# EAGLE design nano_ieee488_v1.1b (EAGLE 6.4)
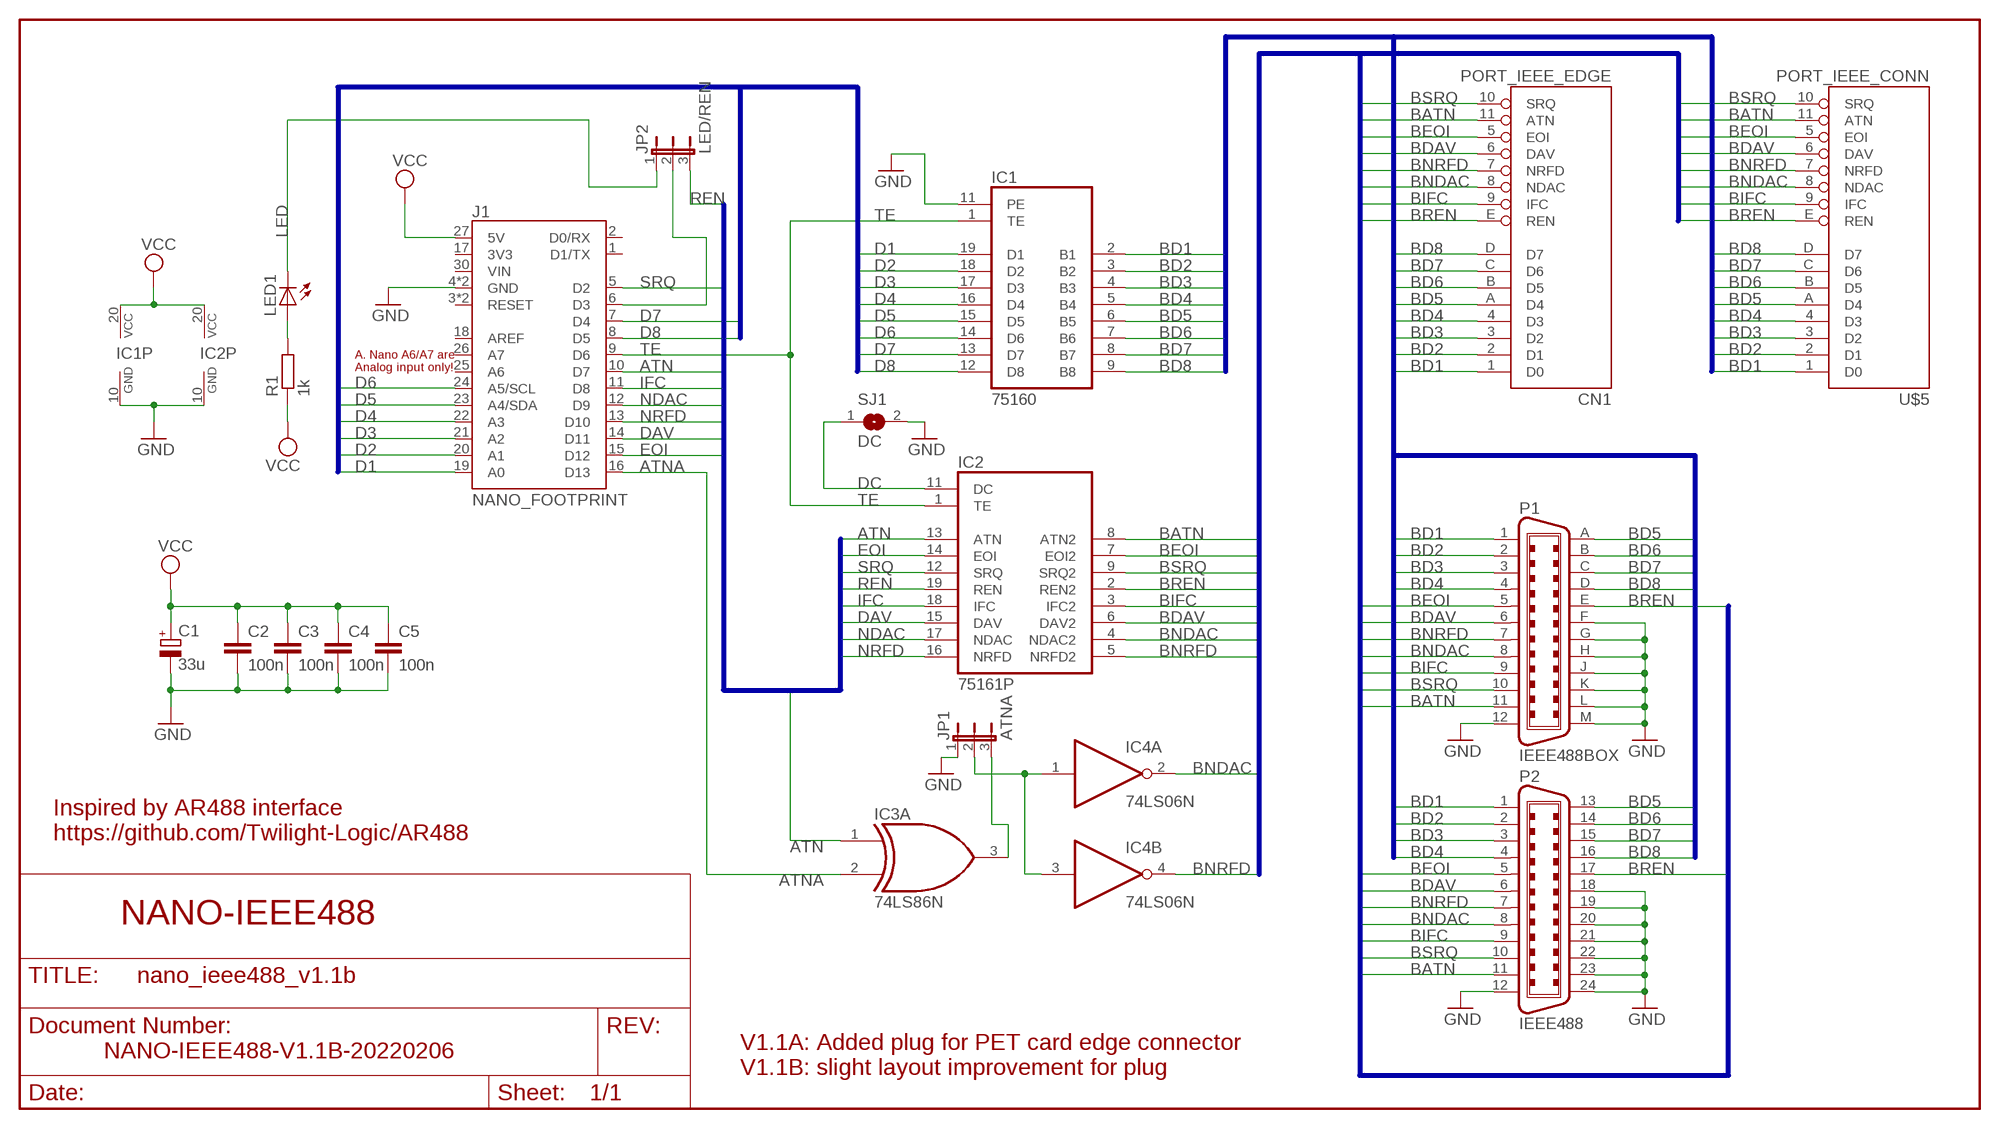
[diagram p0: schematic, sheet 1]

## Parts
C1  33u  CPOL-EUE2.5-7  [E2,5-7]
C2  100n  C-EU025-025X050  [C025-025X050]
C3  100n  C-EU025-025X050  [C025-025X050]
C4  100n  C-EU025-025X050  [C025-025X050]
C5  100n  C-EU025-025X050  [C025-025X050]
CN1  PORT_IEEE_EDGE  [MA156_12-2_IEEE]
IC1  75160  75160P  [DIL20]
IC2  75161P  [DIL20]
IC3  74LS86N  [DIL14]
IC4  74LS06N  [DIL14]
J1  NANO_FOOTPRINT  [NANO]
JP1  ATNA  JP2E  [JP2]
JP2  LED/REN  JP2E  [JP2]
LED1  LED3MM  [LED3MM]
P1  IEEE488BOX  [FLAT24BOX]
P2  IEEE488  [24HP]
R1  1k  R-EU_0204/5  [0204/5]
SJ1  DC  SJW  [SJW]
U$5  PORT_IEEE_CONN  [MA156_12-2_SHORT]

## Nets
ATN: IC2.13(ATN) IC3.1(A:I0) J1.10(D7)
ATNA: IC3.2(A:I1) J1.16(D13)
BATN: CN1.11(ATN) IC2.8(ATN2) P1.11 P2.11 U$5.11(ATN)
BD1: CN1.1(D0) IC1.2(B1) P1.1 P2.1 U$5.1(D0)
BD2: CN1.2(D1) IC1.3(B2) P1.2 P2.2 U$5.2(D1)
BD3: CN1.3(D2) IC1.4(B3) P1.3 P2.3 U$5.3(D2)
BD4: CN1.4(D3) IC1.5(B4) P1.4 P2.4 U$5.4(D3)
BD5: CN1.A(D4) IC1.6(B5) P1.A P2.13 U$5.A(D4)
BD6: CN1.B(D5) IC1.7(B6) P1.B P2.14 U$5.B(D5)
BD7: CN1.C(D6) IC1.8(B7) P1.C P2.15 U$5.C(D6)
BD8: CN1.D(D7) IC1.9(B8) P1.D P2.16 U$5.D(D7)
BDAV: CN1.6(DAV) IC2.6(DAV2) P1.6 P2.6 U$5.6(DAV)
BEOI: CN1.5(EOI) IC2.7(EOI2) P1.5 P2.5 U$5.5(EOI)
BIFC: CN1.9(IFC) IC2.3(IFC2) P1.9 P2.9 U$5.9(IFC)
BNDAC: CN1.8(NDAC) IC2.4(NDAC2) IC4.2(A:O) P1.8 P2.8 U$5.8(NDAC)
BNRFD: CN1.7(NRFD) IC2.5(NRFD2) IC4.4(B:O) P1.7 P2.7 U$5.7(NRFD)
BREN: CN1.E(REN) IC2.2(REN2) P1.E P2.17 U$5.E(REN)
BSRQ: CN1.10(SRQ) IC2.9(SRQ2) P1.10 P2.10 U$5.10(SRQ)
D1: IC1.19(D1) J1.19(A0)
D2: IC1.18(D2) J1.20(A1)
D3: IC1.17(D3) J1.21(A2)
D4: IC1.16(D4) J1.22(A3)
D5: IC1.15(D5) J1.23(A4/SDA)
D6: IC1.14(D6) J1.24(A5/SCL)
D7: IC1.13(D7) J1.7(D4)
D8: IC1.12(D8) J1.8(D5)
DAV: IC2.15(DAV) J1.14(D11)
DC: IC2.11(DC) SJ1.1
EOI: IC2.14(EOI) J1.15(D12)
GND: C1.- C2.2 C3.2 C4.2 C5.2 IC1.10(GND) IC1.11(PE) IC2.10(GND) J1.4(GND) J1.29(GND) JP1.1 P1.12 P1.F P1.G P1.H P1.J P1.K P1.L P1.M P2.12 P2.18 P2.19 P2.20 P2.21 P2.22 P2.23 P2.24 SJ1.2
IFC: IC2.18(IFC) J1.11(D8)
LED: JP2.1 LED1.K(C)
N$1: IC3.3(A:O) JP1.3
N$2: IC4.1(A:I) IC4.3(B:I) JP1.2
N$3: LED1.A R1.2
N$4: J1.6(D3) JP2.2
NDAC: IC2.17(NDAC) J1.12(D9)
NRFD: IC2.16(NRFD) J1.13(D10)
REN: IC2.19(REN) JP2.3
SRQ: IC2.12(SRQ) J1.5(D2)
TE: IC1.1(TE) IC2.1(TE) J1.9(D6)
VCC: C1.+ C2.1 C3.1 C4.1 C5.1 IC1.20(VCC) IC2.20(VCC) J1.27(5V) R1.1
Unconnected: IC3.4(B:I0) IC3.5(B:I1) IC3.6(B:O) IC3.8(C:O) IC3.9(C:I0) IC3.10(C:I1) IC3.11(D:O) IC3.12(D:I0) IC3.13(D:I1) IC4.5(C:I) IC4.6(C:O) IC4.8(D:O) IC4.9(D:I) IC4.10(E:O) IC4.11(E:I) IC4.12(F:O) IC4.13(F:I) J1.1(D1/TX) J1.2(D0/RX) J1.3(RESET) J1.17(3V3) J1.18(AREF) J1.25(A6) J1.26(A7) J1.28(RESET) J1.30(VIN)

## Buses
D[1..8]
ATN,EOI,SRQ,REN,IFC,DAV,NDAC,NRFD
BD[1..8]
BATN,BEOI,BSRQ,BREN,BIFC,BDAV,BNDAC,BNRFD

## Notes on the sheet
- A. Nano A6/A7 are
  Analog input only!
- Inspired by AR488 interface
  https://github.com/Twilight-Logic/AR488
- NANO-IEEE488
- NANO-IEEE488-V1.1B-20220206
- V1.1A: Added plug for PET card edge connector
  V1.1B: slight layout improvement for plug

## Power pins joined to a net without a drawn wire
GND: CN1.12(GND) CN1.F(GND) CN1.H(GND) CN1.J(GND) CN1.K(GND) CN1.L(GND) CN1.M(GND) CN1.N(GND) IC3.7(P:GND) IC4.7(P:GND) U$5.12(GND) U$5.F(GND) U$5.H(GND) U$5.J(GND) U$5.K(GND) U$5.L(GND) U$5.M(GND) U$5.N(GND)
VCC: IC3.14(P:VCC) IC4.14(P:VCC)

## Library data of the parts
C1 = rcl:CPOL-EU: POLARIZED CAPACITOR, European symbol
C2-C5 = rcl:C-EU: CAPACITOR, European symbol
CN1 = commodore:PORT_IEEE_EDGE: IEEE connector for various Commodore computers, PET/CBM type, edge version
IC1 = 751xx:75160: 75xxx DEVICE
IC2 = 751xx:75161: 75xxx DEVICE
IC3 = 74xx-us:74*86: Quad 2-input EXCLUSIV-OR (XOR) gate
IC4 = 74xx-us:74*06: Hex INVERTER, open collector high-voltage output
J1 = SparkFun-Boards:NANO_FOOTPRINT: Generic Nano Footprint
JP1 JP2 = jumper:JP2E: JUMPER
LED1 = led:LED: LED OSRAM: - CHIPLED LG R971, LG N971, LY N971, LG Q971, LY Q971, LO R971, LY R971 LH N974, LH R974 LS Q976, LO Q976, LY Q976 LO Q996 - Hyper CHIPLED LW Q18S LB Q993, LB Q99A, LB R99A - SideLED LS A670, LO A670, LY A670, LG A670, LP A670 LB A673, LV A673, LT A673, LW A673 LH A674 LY A675 LS A676, LA A676, LO A676, LY A676, LW A676 LS A679, LY A679, LG A679 - Hyper Micro SIDELED® LS Y876, LA Y876, LO Y876, LY Y876 LT Y87S - SmartLED LW L88C, LW L88S LB L89C, LB L89S, LG L890 LS L89K, LO L89K, LY L89K LS L896, LA L896, LO L896, LY L896 - TOPLED LS T670, LO T670, LY T670, LG T670, LP T670 LSG T670, LSP T670, LSY T670, LOP T670, LYG T670 LG T671, LOG T671, LSG T671 LB T673, LV T673, LT T673, LW T673 LH T674 LS T676, LA T676, LO T676, LY T676, LB T676, LH T676, LSB T676, LW T676 LB T67C, LV T67C, LT T67C, LS T67K, LO T67K, LY T67K, LW E67C LS E67B, LA E67B, LO E67B, LY E67B, LB E67C, LV E67C, LT E67C LW T67C LS T679, LY T679, LG T679 LS T770, LO T770, LY T770, LG T770, LP T770 LB T773, LV T773, LT T773, LW T773 LH T774 LS E675, LA E675, LY E675, LS T675 LS T776, LA T776, LO T776, LY T776, LB T776 LHGB T686 LT T68C, LB T68C - Hyper Mini TOPLED® LB M676 - Mini TOPLED Santana® LG M470 LS M47K, LO M47K, LY M47K Source: http://www.osram.convergy.de LUXEON: - LUMILED® LXK2-PW12-R00, LXK2-PW12-S00, LXK2-PW14-U00, LXK2-PW14-V00 LXK2-PM12-R00, LXK2-PM12-S00, LXK2-PM14-U00 LXK2-PE12-Q00, LXK2-PE12-R00, LXK2-PE12-S00, LXK2-PE14-T00, LXK2-PE14-U00 LXK2-PB12-K00, LXK2-PB12-L00, LXK2-PB12-M00, LXK2-PB14-N00, LXK2-PB14-P00, LXK2-PB14-Q00 LXK2-PR12-L00, LXK2-PR12-M00, LXK2-PR14-Q00, LXK2-PR14-R00 LXK2-PD12-Q00, LXK2-PD12-R00, LXK2-PD12-S00 LXK2-PH12-R00, LXK2-PH12-S00 LXK2-PL12-P00, LXK2-PL12-Q00, LXK2-PL12-R00 Source: www.luxeon.com KINGBRIGHT: KA-3528ASYC Source: www.kingbright.com
P1 P2 = csa:IEEE488
R1 = rcl:R-EU_: RESISTOR, European symbol
SJ1 = jumper:SJ: SMD solder JUMPER
U$5 = commodore:PORT_IEEE_CONN

## Board
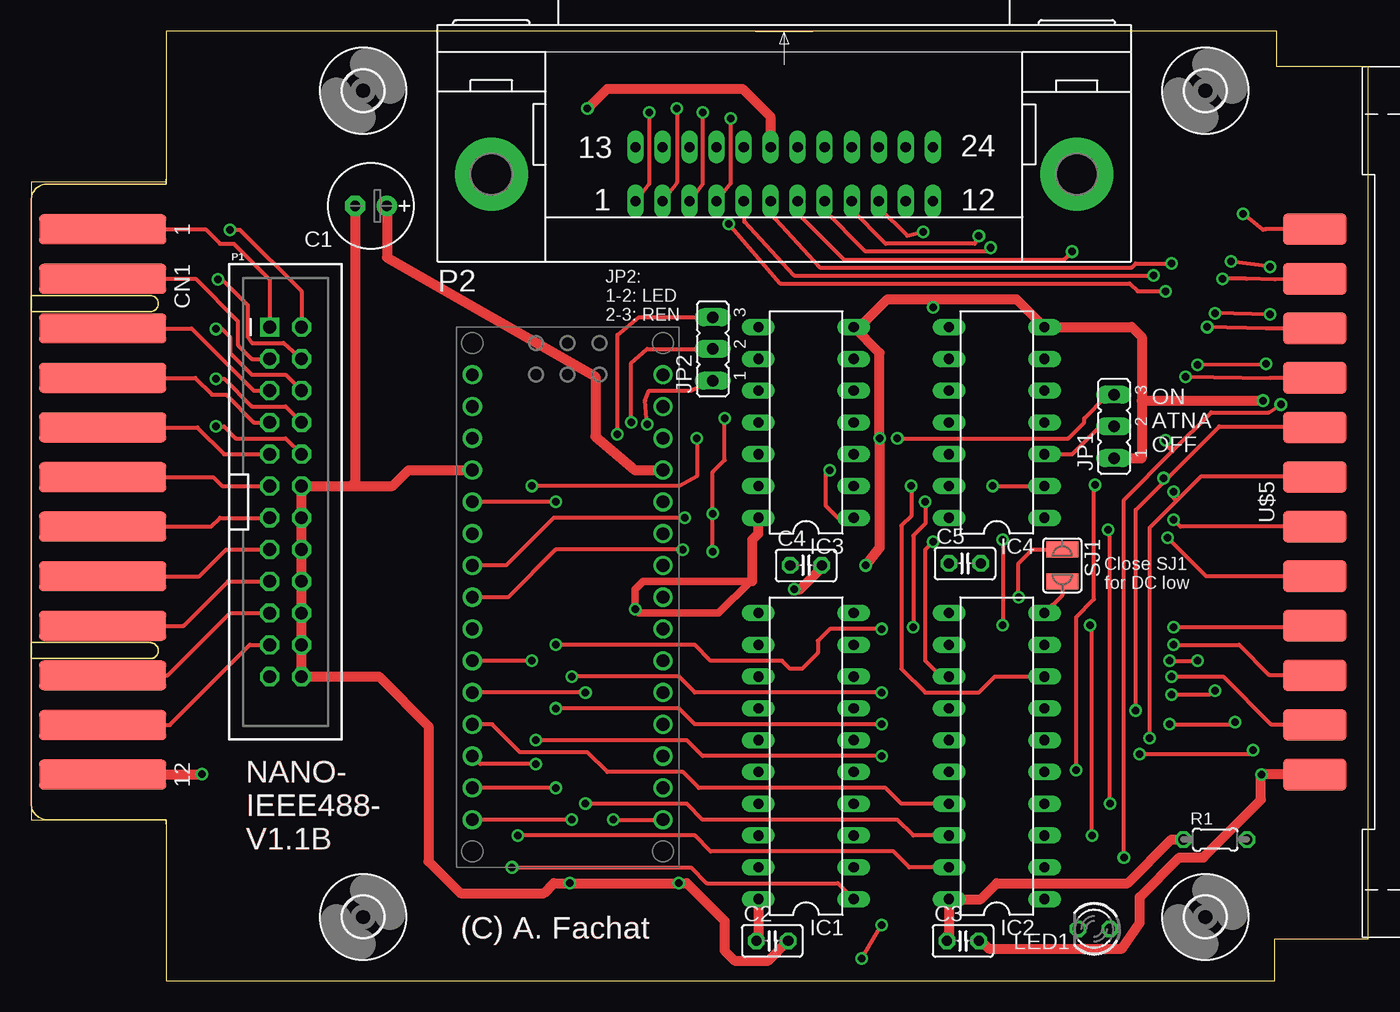
[diagram p1: board, top side]
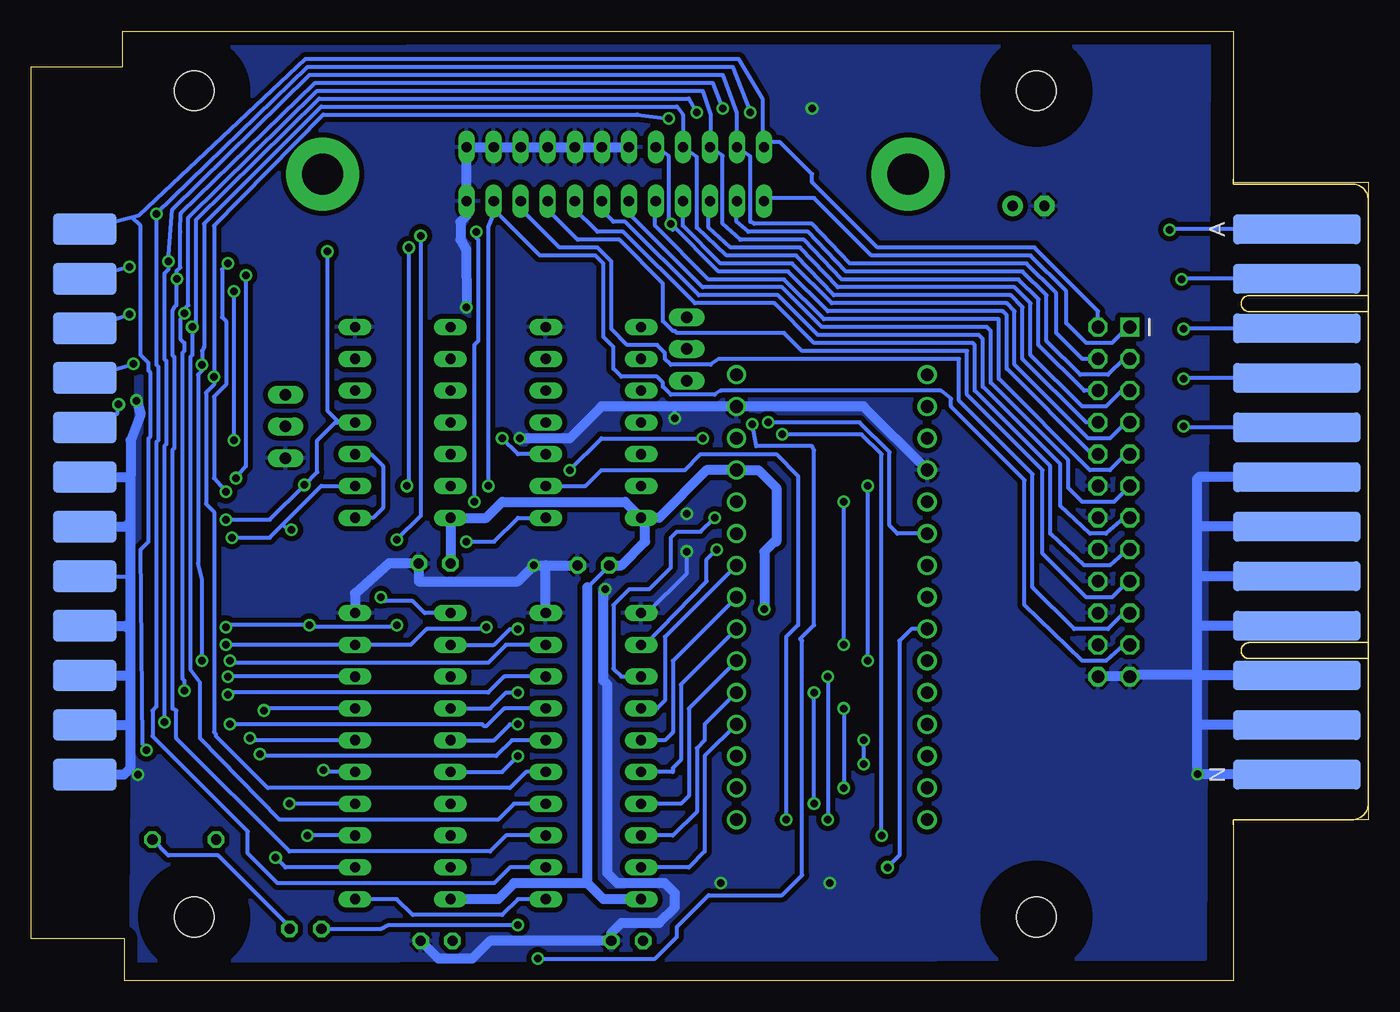
[diagram p2: board, bottom side, seen from below]

Size 106.84 x 75.87 mm. Coordinates in mm from the lower left corner, seen from the top.
Outline: 10.79,0 99.36,0 99.38,3.33 106.84,3.33 106.84,73.03 99.54,73.03 99.54,75.87 10.79,75.87 10.79,63.82 0,63.82 0,12.86 10.79,12.86 10.79,0
Copper layers (1*16): Top 0.035mm / dielectric 1.5mm / Bottom 0.035mm
Design rules "default *": minimum track width 10mil, minimum drill 12mil, track to track 8mil, track to pad 8mil, pad to pad 8mil, via to via 8mil, smd to smd 8mil, copper to edge 40mil, drill to drill 8mil, minimum pad ring 10mil, minimum via ring 8mil, stop-mask expansion 4mil, vias tented up to drill 0mil, thermal gap 10mil

### Footprints (pad centres in the part's own frame; a part is rotated, then mirrored left to right if it is on the bottom)
E2,5-7 = drill 0.813 pad 1.6: + -1.27,0 | drill 0.813 pad 1.6 octagon: - 1.27,0
C025-025X050 = drill 0.813 octagon: 1 -1.27,0; 2 1.27,0
MA156_12-2_IEEE = smd 2.388 x 10.16: 1 -21.793,0; 2 -17.831,0; 3 -13.868,0; 4 -9.906,0; 5 -5.944,0; 6 -1.981,0; 7 1.981,0; 8 5.944,0; 9 9.906,0; 10 13.868,0; 11 17.831,0; 12 21.793,0 | smd 2.388 x 10.16 bottom: A -21.793,0; B -17.831,0; C -13.868,0; D -9.906,0; E -5.944,0; F -1.981,0; H 1.981,0; J 5.944,0; K 9.906,0; L 13.868,0; M 17.831,0; N 21.793,0
DIL20 = drill 0.813 long: 1 -11.43,-3.81; 2 -8.89,-3.81; 3 -6.35,-3.81; 4 -3.81,-3.81; 5 -1.27,-3.81; 6 1.27,-3.81; 7 3.81,-3.81; 8 6.35,-3.81; 9 8.89,-3.81; 10 11.43,-3.81; 11 11.43,3.81; 12 8.89,3.81; 13 6.35,3.81; 14 3.81,3.81; 15 1.27,3.81; 16 -1.27,3.81; 17 -3.81,3.81; 18 -6.35,3.81; 19 -8.89,3.81; 20 -11.43,3.81
DIL14 = drill 0.813 long: 1 -7.62,-3.81; 2 -5.08,-3.81; 3 -2.54,-3.81; 4 0,-3.81; 5 2.54,-3.81; 6 5.08,-3.81; 7 7.62,-3.81; 8 7.62,3.81; 9 5.08,3.81; 10 2.54,3.81; 11 0,3.81; 12 -2.54,3.81; 13 -5.08,3.81; 14 -7.62,3.81
NANO = drill 1.016: 1 -7.62,17.78; 2 -7.62,15.24; 3 -7.62,12.7; 4 -7.62,10.16; 5 -7.62,7.62; 6 -7.62,5.08; 7 -7.62,2.54; 8 -7.62,0; 9 -7.62,-2.54; 10 -7.62,-5.08; 11 -7.62,-7.62; 12 -7.62,-10.16; 13 -7.62,-12.7; 14 -7.62,-15.24; 15 -7.62,-17.78; 16 7.62,-17.78; 17 7.62,-15.24; 18 7.62,-12.7; 19 7.62,-10.16; 20 7.62,-7.62; 21 7.62,-5.08; 22 7.62,-2.54; 23 7.62,0; 24 7.62,2.54; 25 7.62,5.08; 26 7.62,7.62; 27 7.62,10.16; 28 7.62,12.7; 29 7.62,15.24; 30 7.62,17.78
JP2 = drill 0.914 long: 1 -2.54,0; 2 0,0; 3 2.54,0
LED3MM = drill 0.813 octagon: A -1.27,0; K 1.27,0
FLAT24BOX = drill 1.016 square: 1 -13.97,-1.27 | drill 1.016 octagon: 2 -11.43,-1.27; 3 -8.89,-1.27; 4 -6.35,-1.27; 5 -3.81,-1.27; 6 -1.27,-1.27; 7 1.27,-1.27; 8 3.81,-1.27; 9 6.35,-1.27; 10 8.89,-1.27; 11 11.43,-1.27; 12 13.97,-1.27; A -13.97,1.27; B -11.43,1.27; C -8.89,1.27; D -6.35,1.27; E -3.81,1.27; F -1.27,1.27; G 1.27,1.27; H 3.81,1.27; J 6.35,1.27; K 8.89,1.27; L 11.43,1.27; M 13.97,1.27
24HP = drill 0.813 long: 1 -11.874,-2.159; 2 -9.716,-2.159; 3 -7.556,-2.159; 4 -5.397,-2.159; 5 -3.239,-2.159; 6 -1.079,-2.159; 7 1.079,-2.159; 8 3.239,-2.159; 9 5.397,-2.159; 10 7.556,-2.159; 11 9.716,-2.159; 12 11.874,-2.159; 13 -11.874,2.159; 14 -9.716,2.159; 15 -7.556,2.159; 16 -5.397,2.159; 17 -3.239,2.159; 18 -1.079,2.159; 19 1.079,2.159; 20 3.239,2.159; 21 5.397,2.159; 22 7.556,2.159; 23 9.716,2.159; 24 11.874,2.159 | drill 3.302 pad 5.842: G -23.393,0; G1 23.393,0
0204/5 = drill 0.813 octagon: 1 -2.54,0; 2 2.54,0
SJW = smd 1.27 x 2.54: 1 -1.27,0; 2 1.27,0
3,2 = hole 3.2: 0,0
MA156_12-2_SHORT = smd 2.54 x 5.08: 1 -21.793,0; 2 -17.831,0; 3 -13.868,0; 4 -9.906,0; 5 -5.944,0; 6 -1.981,0; 7 1.981,0; 8 5.944,0; 9 9.906,0; 10 13.868,0; 11 17.831,0; 12 21.793,0 | smd 2.54 x 5.08 bottom: A -21.793,0; B -17.831,0; C -13.868,0; D -9.906,0; E -5.944,0; F -1.981,0; H 1.981,0; J 5.944,0; K 9.906,0; L 13.868,0; M 17.831,0; N 21.793,0

### Placement (x,y rotation side)
C1  27.15,61.91 180 top
C2  59.21,3.17 0 top
C3  74.45,3.17 0 top
C4  61.91,33.18 0 top
C5  74.61,33.34 0 top
CN1  5.71,38.26 270 top
IC1  61.91,17.94 90 top
IC2  77.15,17.94 90 top
IC3  61.91,44.61 90 top
IC4  77.15,44.61 90 top
J1  42.86,30.64 0 top
JP1  86.52,44.29 90 top
JP2  54.45,50.48 90 top
LED1  84.93,4.13 180 top
P1  20.32,38.26 270 top
P2  60.17,64.45 0 top
R1  94.62,11.27 0 top
SJ1  82.39,33.18 270 top
U$1  [3,2]  26.51,71.12 0 top
U$2  [3,2]  93.82,71.12 0 top
U$3  [3,2]  26.51,5.08 0 top
U$4  [3,2]  93.82,5.08 0 top
U$5  102.55,38.26 270 top

### Tracks (layer width: path | path; a pad name or v marks a point on that pad's centre or on a via)
ATN  (via drill 0.6)
  Top 0.305: IC2.13 72.71,24.29 71.44,25.56 71.44,34.45 v72.07,35.08 | IC3.1 64.45,36.99 63.5,37.94 63.5,40.48 v63.82,40.8 | v53.18,43.34 53.18,40.32 51.75,39.53 v40,39.53 | v40,25.56 J1.10
  Bottom 0.305: v72.07,35.08 69.85,35.08 67.94,36.99 IC3.1 | v63.82,40.8 61.28,43.34 v53.18,43.34 | v40,39.53 v40,25.56
ATNA  (via drill 0.6)
  Top 0.305: v46.51,12.86 J1.16
  Bottom 0.305: IC3.2 62.55,39.53 61.28,40.8 54.61,40.8 53.34,42.07 47.31,42.07 45.56,40.32 45.56,28.42 46.51,27.46 v46.51,12.86
BATN  (via drill 0.6)
  Top 0.305: CN1.11 11.06,20.43 17.46,26.83 P1.11 | U$5.11 102.5,20.48 99.06,20.48 95.25,24.29 v91.12,24.29 | v70.33,39.53 70.33,37.15 69.53,36.35 69.53,24.92 71.44,23.02 75.72,23.02 76.99,24.29 IC2.8
  Bottom 0.305: P1.11 19.53,26.83 20.95,25.56 22.86,25.56 27.46,30 27.46,40.01 33.34,45.88 33.34,46.51 34.13,47.15 51.75,47.15 52.23,46.83 55.72,46.83 56.36,47.47 56.36,47.78 56.83,48.26 59.69,48.26 60.32,48.9 60.32,50.64 61.12,51.44 61.12,57.31 61.75,57.94 66.2,57.94 69.85,61.59 69.85,62.58 P2.11 69.77,62.18 69.77,61.52 70.33,60.17 v70.33,39.53 | IC2.8 v91.12,24.29
BD1  (via drill 0.6)
  Top 0.305: CN1.1 13.93,60.05 15.08,58.9 16.19,58.9 19.05,56.04 P1.1 | U$5.1 98.63,60.05 98.42,60.01 v96.84,61.28 | v49.37,69.37 49.37,63.69 P2.1
  Bottom 0.305: IC1.2 68.58,9.05 69.85,7.78 87.15,7.78 89.53,10.16 89.53,11.91 97.15,19.53 97.15,21.59 96.84,21.91 96.84,43.02 96.68,43.18 96.68,49.05 96.84,49.21 v96.84,61.28 84.77,73.03 50.8,73.03 v49.37,69.37 | P1.1 19.21,52.23 20.48,50.96 22.54,50.96 24.13,52.55 24.13,55.09 26.99,57.94 39.69,57.94 44.29,62.55 48.23,62.55 P2.1
BD2  (via drill 0.6)
  Top 0.305: CN1.2 13.13,56.09 16.51,52.7 16.51,50.8 17.62,49.69 P1.2 | U$5.2 99.38,56.04 97.1,56.09 v95.2,56.09 | v51.59,69.69 51.59,63.75 P2.2
  Bottom 0.305: IC1.3 68.9,11.59 70.17,10.32 86.2,10.32 95.25,19.37 95.25,21.59 95.57,21.75 95.57,42.39 95.41,42.55 95.41,49.85 95.57,50.01 95.57,53.5 95.41,53.82 95.25,53.98 95.25,56.04 v95.2,56.09 95.2,56.73 94.93,56.99 94.93,59.85 94.88,61.33 84.14,71.75 52.39,71.75 v51.59,69.69 | P1.2 19.53,49.69 20.8,48.42 23.02,48.42 25.72,51.12 25.72,54.77 27.62,56.67 41.75,56.67 44.77,59.85 49.53,59.85 50.48,60.64 50.48,62.58 P2.2
BD3  (via drill 0.6)
  Top 0.305: CN1.3 12.8,52.13 17.78,47.15 P1.3 | U$5.3 98.69,52.13 v93.98,52.23 | v53.66,69.37 53.66,63.66 P2.3
  Bottom 0.305: IC1.4 68.26,14.13 69.53,12.86 86.99,12.86 93.34,19.37 93.34,23.81 94.14,24.92 94.14,49.85 93.98,50.01 v93.98,52.23 93.66,52.55 93.66,60.8 83.82,70.48 54.29,70.48 v53.66,69.37 | P1.3 19.68,47.15 20.95,45.88 22.86,45.88 26.99,50.01 26.99,54.13 28.26,55.4 42.39,55.4 45.4,58.58 50.96,58.58 52.7,60.17 52.7,62.52 P2.3
BD4  (via drill 0.6)
  Top 0.305: CN1.4 13.11,48.16 14.45,46.83 15.56,46.83 17.78,44.61 P1.4 | U$5.4 99,48.16 v92.23,48.26 | v55.88,68.9 55.88,63.72 P2.4
  Bottom 0.305: IC1.5 67.31,16.67 68.58,15.4 87.95,15.4 92.07,19.53 92.07,19.68 92.23,19.84 92.23,37.47 92.87,38.1 92.87,46.99 92.23,47.62 v92.23,48.26 92.23,60.33 83.5,69.22 58.42,69.22 v55.88,68.9 | P1.4 19.37,44.61 20.64,43.34 22.38,43.34 28.26,49.21 28.26,53.5 28.89,54.13 42.86,54.13 46.04,57.31 51.75,57.31 54.77,60.33 P2.4
BD5  (via drill 0.6)
  Top 0.305: v15.87,60.01 16.67,60.01 21.59,55.09 P1.A | v88.58,18.1 97.31,18.1 v97.63,18.41
  Bottom 0.305: CN1.A 15.83,60.05 v15.87,60.01 | P1.A 21.59,53.5 26.67,58.58 39.21,58.58 44.45,63.82 44.45,64.45 46.99,66.99 48.23,66.99 P2.13 48.42,67.06 48.42,70.48 50.32,73.66 84.93,73.66 98.22,61.16 98.8,61.01 | U$5.A 98.8,61.01 | IC1.6 68.42,19.21 69.69,17.94 88.42,17.94 v88.58,18.1 | v97.63,18.41 97.63,18.57 97.95,18.89 98.11,34.45 97.47,35.08 97.47,43.34 97.31,43.5 97.31,48.58 97.47,48.74 97.47,49.37 98.11,50.01 98.11,60.32 98.8,61.01
BD6  (via drill 0.6)
  Top 0.305: v14.92,56.04 15.24,56.04 17.3,53.98 17.3,51.44 17.62,50.96 20.16,50.96 P1.B | v99.01,57.04 v95.88,57.47 | v90.96,20.48 96.04,20.48 v96.2,20.64
  Bottom 0.305: CN1.B 14.87,56.09 v14.92,56.04 | P1.B 22.86,49.69 24.92,51.75 24.92,54.93 27.3,57.31 41.43,57.31 44.45,60.48 49.05,60.48 49.37,60.64 49.37,65.85 P2.14 50.48,66.96 50.48,69.37 51.59,72.39 84.61,72.39 95.57,61.59 v95.88,57.47 95.88,56.83 96.2,56.52 96.2,49.69 96.04,49.53 96.04,42.86 96.2,42.7 v96.2,20.64 | U$5.B v99.01,57.04 | IC1.7 69.06,21.75 70.48,20.32 70.64,20.32 70.8,20.48 v90.96,20.48
BD7  (via drill 0.6)
  Top 0.305: v14.76,52.07 15.24,52.07 15.87,51.44 15.87,50.16 17.62,48.42 20.32,48.42 P1.C | v99,53.24 v94.61,53.34 | v91.12,22.86 94.14,22.86 v94.61,23.18
  Bottom 0.305: CN1.C 14.71,52.13 v14.76,52.07 | P1.C 22.7,47.15 26.35,50.8 26.35,54.45 27.94,56.04 42.07,56.04 45.08,59.21 50.16,59.21 51.59,60.48 51.59,65.91 P2.15 52.55,66.99 52.55,69.22 53.18,71.12 83.98,71.12 94.3,60.96 94.3,53.98 94.61,53.66 v94.61,53.34 94.61,53.18 94.93,52.86 94.93,51.28 94.61,50.96 94.61,50.32 94.77,50.16 94.77,24.13 94.61,23.97 v94.61,23.18 | U$5.C v99,53.24 | IC1.8 69.06,24.29 70.33,23.02 90.96,23.02 v91.12,22.86
BD8  (via drill 0.6)
  Top 0.305: v14.76,48.1 15.4,48.1 17.62,45.88 20.32,45.88 P1.D | v93.19,49.21 v98.68,49.28 | v90.96,25.56 v93.19,25.56
  Bottom 0.305: CN1.D 14.7,48.16 v14.76,48.1 | P1.D 22.54,44.61 27.62,49.69 27.62,53.82 28.57,54.77 42.7,54.77 45.72,57.94 51.28,57.94 53.66,60.17 53.66,65.82 P2.16 54.77,69.22 55.24,69.85 83.66,69.85 93.03,60.48 93.03,50.64 93.19,50.32 v93.19,49.21 93.19,48.74 93.5,48.42 93.5,33.34 93.19,32.07 v93.19,25.56 | U$5.D v98.68,49.28 | IC1.9 68.9,26.83 70.33,25.4 90.8,25.4 v90.96,25.56
BDAV  (via drill 0.6)
  Top 0.305: CN1.6 14.53,40.24 15.24,39.53 P1.6 | v89.38,19.37 89.38,36.2 91.52,38.34 | 91.52,38.34 93.5,40.32 102.47,40.32 U$5.6 | P2.6 59.05,62.26 59.05,61.28 63.02,56.99 87.95,56.99 88.26,57.31 v91.12,57.31 | v91.28,39.05 91.28,38.58 91.52,38.34
  Bottom 0.305: P1.6 20.32,38.26 22.86,38.26 23.97,39.37 23.97,41.59 30.16,47.78 30.16,51.91 30.48,52.23 43.66,52.23 46.83,55.4 53.18,55.4 59.05,61.28 59.05,62.1 P2.6 | IC2.6 89.22,19.21 v89.38,19.37 | v91.12,57.31 91.28,57.31 91.6,56.83 91.6,53.02 91.28,52.7 91.28,47.62 92.23,46.67 92.23,40.16 v91.28,39.05
BEOI  (via drill 0.6)
  Top 0.305: CN1.5 13.26,44.2 15.4,42.07 P1.5 | v88.26,21.59 88.26,37.62 90.65,40.01 | 90.65,40.01 94.93,44.29 102.46,44.29 U$5.5 | P2.5 56.99,62.23 56.99,60.64 60.96,56.36 v89.69,56.36 | 90.33,40.32 v90.49,40.16 90.65,40.01
  Bottom 0.305: P1.5 19.37,42.07 20.64,40.8 22.22,40.8 29.53,48.1 29.53,52.86 43.5,52.86 46.67,56.04 52.7,56.04 56.99,60.33 56.99,62.23 P2.5 | IC2.7 88.11,21.75 v88.26,21.59 | v89.69,56.36 89.69,41.12 v90.49,40.16
BIFC  (via drill 0.6)
  Top 0.305: CN1.9 12.16,28.35 15.72,31.91 P1.9 | v84.77,11.59 84.77,28.26 v84.61,28.42 | v91.28,28.26 102.46,28.26 U$5.9 | P2.9 65.56,61.59 68.26,58.9 75.41,58.9 v75.72,59.53 | v77.63,35.24 v77.63,28.42
  Bottom 0.305: P1.9 19.21,31.91 20.48,30.64 22.54,30.64 26.03,34.13 26.03,40.8 32.07,46.83 32.07,50.32 45.24,50.32 46.67,51.75 55.24,51.75 55.4,51.91 55.56,51.91 56.36,52.7 56.36,55.72 59.85,59.21 63.18,59.21 65.56,61.59 P2.9 | IC2.3 v84.77,11.59 | v91.28,28.26 91.28,28.42 v84.61,28.42 84.45,28.26 77.79,28.26 v77.63,28.42 | v75.72,59.53 75.72,37.15 v77.63,35.24
BNDAC  (via drill 0.6)
  Top 0.305: CN1.8 13.42,32.31 15.56,34.45 P1.8 | U$5.8 93.89,32.31 v90.8,35.4 | v86.2,14.13 86.2,35.88 v86.04,36.04 | P2.8 63.34,62.23 63.34,61.59 66.67,58.26 76.36,58.26 v76.68,58.58 | v76.83,39.53 IC4.2
  Bottom 0.305: P1.8 19.21,34.45 20.64,33.18 22.7,33.18 25.4,35.72 25.4,41.12 31.43,47.15 31.43,50.8 31.59,50.96 44.29,50.96 47.47,54.13 53.82,54.13 59.53,59.85 61.59,59.85 63.5,61.75 63.5,62.2 P2.8 | v90.8,35.4 87.79,35.4 86.76,36.43 | 86.76,36.43 83.66,39.53 IC4.2 | IC2.4 v86.2,14.13 | v86.04,36.04 86.36,36.04 86.76,36.43 | v76.68,58.58 76.68,39.69 v76.83,39.53
BNRFD  (via drill 0.6)
  Top 0.305: CN1.7 14.37,36.28 15.08,36.99 P1.7 | U$5.7 91.83,36.28 v91.28,36.83 | v83.5,16.83 83.5,29.05 84.93,30.48 84.93,39.53 v85.01,39.61 | P2.7 61.12,62.17 61.12,61.44 64.93,57.63 82.55,57.63 v83.18,58.26
  Bottom 0.305: P1.7 19.53,36.99 20.95,35.72 22.22,35.72 24.61,37.94 24.61,41.27 30.8,47.47 30.8,51.28 31.11,51.59 43.97,51.59 47.15,54.77 53.5,54.77 59.37,60.64 60.32,60.64 61.28,61.59 61.28,62.26 P2.7 | v91.28,36.83 87.79,36.83 v85.01,39.61 83.98,40.64 83.98,43.18 82.55,44.61 82.23,44.61 | 82.23,44.61 IC4.4 | IC2.5 83.34,16.67 v83.5,16.83 | v83.18,58.26 83.18,45.56 82.23,44.61
BREN  (via drill 0.6)
  Top 0.305: v14.76,44.29 15.4,44.29 16.35,43.34 20.32,43.34 P1.E | v87.31,9.84 87.31,38.42 91.2,42.31 | 91.2,42.31 94.3,45.4 98.9,45.4 v99.85,46.04 | v55.72,60.48 59.85,55.72 87.79,55.72 88.42,55.09 v90.65,55.09 | v90.65,43.18 90.96,42.55 91.2,42.31
  Bottom 0.305: CN1.E 14.67,44.2 v14.76,44.29 | P1.E 22.07,42.07 28.89,48.9 28.89,53.18 29.21,53.5 43.18,53.5 46.35,56.67 51.91,56.67 v55.72,60.48 | v55.72,60.48 55.88,60.64 55.88,65.88 P2.17 | IC2.2 86.52,9.05 v87.31,9.84 | v99.85,46.04 100.01,45.24 101.51,45.24 U$5.E | 55.56,60.01 v55.72,60.48 | v90.65,55.09 v90.65,43.18
BSRQ  (via drill 0.6)
  Top 0.305: CN1.10 10.9,24.39 15.87,29.37 P1.10 | U$5.10 102.5,24.45 98.9,24.45 96.52,26.83 v91.28,26.83 | v71.28,59.85 70.01,59.53 67.79,61.75 67.79,62.23 P2.10 | v71.44,38.26 71.44,36.51 70.48,35.56 v70.48,28.26
  Bottom 0.305: P1.10 19.53,29.37 20.8,28.1 23.49,28.1 26.83,31.43 26.83,40.48 32.7,46.35 32.7,49.69 51.91,49.69 52.55,49.21 55.72,49.21 56.2,49.69 56.2,50.16 56.83,50.8 59.21,50.8 60.48,52.07 60.48,57.47 61.59,58.58 64.61,58.58 67.79,61.75 67.79,62.55 P2.10 | v91.28,26.83 IC2.9 76.52,26.83 75.25,28.1 70.8,28.1 70.64,28.26 v70.48,28.26 | v71.28,59.85 71.28,59.37 71.12,59.21 71.12,51.12 71.44,50.8 v71.44,38.26
D1
  Bottom 0.305: J1.19 53.02,17.94 53.02,10.32 54.29,9.05 IC1.19
D2
  Bottom 0.305: J1.20 53.02,20.48 53.02,19.21 53.66,18.57 53.66,13.49 55.56,11.59 IC1.18
D3
  Bottom 0.305: J1.21 54.29,21.75 54.29,14.76 54.93,14.13 IC1.17
D4
  Bottom 0.305: J1.22 54.93,23.65 54.93,17.62 55.56,16.99 55.56,16.67 IC1.16
D5
  Bottom 0.305: J1.23 55.56,25.56 55.56,19.84 56.2,19.21 IC1.15
D6
  Bottom 0.305: J1.24 56.2,27.46 56.2,22.38 56.83,21.75 IC1.14
D7  (via drill 0.6)
  Top 0.305: v52.23,36.99 41.75,36.99 37.94,33.18 J1.7
  Bottom 0.305: IC1.13 59.69,24.29 60.32,24.92 60.32,30 59.05,31.27 57.47,31.27 55.72,33.02 55.72,35.4 55.24,35.88 53.34,35.88 v52.23,36.99
D8  (via drill 0.6)
  Top 0.305: v52.07,34.45 41.91,34.45 38.1,30.64 J1.8
  Bottom 0.305: IC1.12 57.78,26.83 52.86,31.91 52.86,33.66 v52.07,34.45
DAV  (via drill 0.6)
  Top 0.305: v67.94,20.48 53.02,20.48 51.75,21.75 v41.91,21.75 | v41.91,15.4 J1.14
  Bottom 0.305: IC2.15 69.85,19.21 68.58,20.48 v67.94,20.48 | v41.91,21.75 v41.91,15.4
DC  (via drill 0.6)
  Top 0.305: v78.9,30.64 78.9,33.34 80.01,34.45 SJ1.1
  Bottom 0.305: IC2.11 75.41,29.37 76.36,30.32 78.58,30.32 v78.9,30.64
EOI  (via drill 0.6)
  Top 0.305: v67.94,23.02 53.02,23.02 51.75,24.29 v43.18,24.29 | v43.18,12.86 J1.15
  Bottom 0.305: IC2.14 70.17,21.75 68.9,23.02 v67.94,23.02 | v43.18,24.29 v43.18,12.86
GND  (via drill 0.6)
  Top 0.305: v54.45,34.29 v54.45,37.31 54.45,40.64 55.4,41.59 v55.4,44.93 | 13.61,16.47 v13.65,16.51 | SJ1.2 82.39,30.8 IC2.10 | 98.27,16.42 v98.31,16.47 | 25.88,39.85 25.56,39.53 | 72.07,54.29 72.23,54.45
  Top 0.813: v66.67,33.18 67.79,34.61 v67.79,43.34 67.79,50.16 IC3.7 66.2,52.23 68.42,54.45 72.23,54.45 78.74,54.45 IC4.7 87.95,52.23 88.74,51.44 88.74,46.35 | CN1.12 13.61,16.47 | J1.4 30.16,40.8 28.89,39.53 25.56,39.53 P1.F P1.G P1.H P1.J P1.K P1.L P1.M 27.78,24.29 31.75,20.32 31.75,9.53 34.29,6.99 40.96,6.99 41.75,7.78 v43.02,7.78 v51.75,7.78 52.39,7.78 55.4,4.76 55.4,2.38 56.2,1.59 58.9,1.59 C2.2 | JP1.1 88.74,41.75 88.74,46.35 | 88.74,46.35 v98.42,46.35 | U$5.N v98.31,16.47 | C3.2 75.88,3.17 76.52,2.54 87.15,2.54 88.58,4.6 88.58,6.67 91.76,9.84 93.66,9.84 98.27,14.45 98.27,16.42 | C1.- 25.88,39.85 | v72.07,53.82 72.07,54.29 | v60.96,31.27 61.44,31.27 63.34,33.18 | v44.45,69.69 46.04,71.28 56.83,71.28 59.05,69.06 59.05,66.67
  Bottom 0.305: IC1.11 57.63,29.37 54.45,32.54 v54.45,34.29 | v55.4,44.93 55.4,45.72 55.56,45.88 | 13.58,40.24 13.65,40.16 | 13.42,36.28 13.65,36.51 | 13.4,32.31 13.65,32.07 | 13.43,28.35 13.65,28.57 | 13.6,24.39 13.65,24.45 | 13.44,20.43 13.65,20.64 | 18.89,24.45 P1.12 | 98.9,16.99 98.9,17.14 98.31,16.55 v98.31,16.47 | 98.95,20.43 98.9,20.48 | 98.96,24.39 98.9,24.45 | U$5.J 99.15,32.31 98.9,32.07 | 98.98,40.24 98.9,40.32 | 72.04,53.85 v72.07,53.82 | 13.61,16.47 v13.65,16.51
  Bottom 0.813: 81.28,29.37 IC2.10 80.96,30.96 78.26,33.34 C5.2 75.88,31.91 67.94,31.91 v66.67,33.18 65.72,33.18 | v67.79,43.34 63.82,43.34 61.28,45.88 55.56,45.88 J1.29 40.32,45.88 J1.4 | 65.72,33.18 C4.2 | IC1.10 65.72,33.18 | v13.65,16.51 13.65,20.64 13.65,24.45 | 13.65,24.45 13.65,28.57 13.65,32.07 13.65,36.51 13.65,40.16 | CN1.F 13.58,40.24 | CN1.H 13.42,36.28 | CN1.J 13.4,32.31 | CN1.K 13.43,28.35 | CN1.L 13.6,24.39 | CN1.M 13.44,20.43 | 13.65,24.45 18.89,24.45 | P1.12 P1.M | 98.9,17.14 98.9,20.48 98.9,24.45 98.9,27.94 | 98.9,27.94 98.9,32.07 98.9,36.67 | 98.9,36.67 98.9,40.32 98.9,43.18 98.11,45.24 v98.42,46.35 | U$5.M 98.95,20.43 | U$5.L 98.96,24.39 | U$5.K 99.31,28.35 98.9,27.94 | U$5.H 99.29,36.28 98.9,36.67 | U$5.F 98.98,40.24 | C3.2 74.29,1.75 71.6,1.75 70.17,3.17 C2.2 60.48,3.81 59.69,4.6 56.67,4.6 55.4,5.87 55.4,6.99 56.2,7.78 60.01,7.78 60.8,8.57 60.8,23.65 61.12,23.97 61.12,31.11 v60.96,31.27 | U$5.N 99.42,16.47 98.9,16.99 | 72.04,53.85 72.07,58.42 72.55,59.21 72.55,60.64 72.04,61.15 P2.12 P2.24 P2.23 P2.22 P2.21 P2.20 P2.19 P2.18 | CN1.12 13.61,16.47
  pour Bottom (isolate 0.406): 12.7,74.77 98.27,74.61 98.9,1.59 13.02,1.75
IFC  (via drill 0.6)
  Top 0.305: IC2.18 70.48,11.59 69.21,12.86 53.66,12.86 52.39,14.13 v44.29,14.13 | v44.29,23.02 J1.11
  Bottom 0.305: v44.29,14.13 v44.29,23.02
LED  (via drill 0.6)
  Top 0.305: v49.21,44.45 49.05,46.35 49.37,47.15 52.7,47.15 JP2.1 | v67.94,4.45 v66.36,1.75
  Bottom 0.305: v49.21,44.45 48.89,42.7 44.45,42.7 44.29,42.39 44.29,28.42 45.4,27.3 45.24,27.15 45.24,8.41 46.83,6.83 52.7,6.83 55.24,4.29 55.24,3.49 56.99,1.75 v66.36,1.75 | LED1.K 78.9,4.13 78.26,4.45 v67.94,4.45
N$1  (via drill 0.6)
  Top 0.305: v69.21,43.34 82.87,43.34 84.14,44.61 84.14,44.93 85.88,46.67 86.36,46.67 JP1.3
  Bottom 0.305: IC3.3 67.94,42.07 v69.21,43.34
N$2
  Top 0.305: IC4.3 83.18,42.07 85.41,44.29 JP1.2
  Bottom 0.305: IC4.3 79.69,42.07 78.74,41.12 78.74,37.78 79.53,36.99 IC4.1
N$3
  Bottom 0.305: LED1.A 86.2,4.29 91.92,10 95.88,10 R1.2
N$4  (via drill 0.6)
  Top 0.305: v47.94,44.61 47.94,49.37 49.21,50.48 JP2.2
  Bottom 0.305: J1.6 37.62,35.72 38.26,36.35 38.26,42.23 40.64,44.61 v47.94,44.61
NDAC
  Top 0.305: IC2.17 69.53,14.13 68.26,15.4 53.34,15.4 52.07,16.67 46.04,16.67 44.45,18.26 39.05,18.26 36.83,20.48 J1.12
NRFD  (via drill 0.6)
  Top 0.305: v67.94,17.94 53.66,17.94 52.39,19.21 v40.32,19.21 | v40.32,17.3 35.88,17.3 J1.13
  Bottom 0.305: IC2.16 69.21,16.67 v67.94,17.94 | v40.32,19.21 v40.32,17.3
REN  (via drill 0.6)
  Top 0.305: IC2.19 70.17,9.05 68.9,10.32 54.29,10.32 53.02,11.59 v38.89,11.59 | v46.83,43.66 46.83,51.59 48.58,53.02 JP2.3
  Bottom 0.305: v38.89,11.59 38.89,42.07 40.48,43.66 v46.83,43.66
SRQ  (via drill 0.6)
  Top 0.305: v67.94,28.1 63.82,28.1 62.86,27.15 62.86,26.19 61.59,24.92 60.64,24.92 60.01,25.56 54.29,25.56 53.02,26.83 v41.91,26.83 | v41.91,38.26 J1.5
  Bottom 0.305: IC2.12 69.85,26.83 68.58,28.1 v67.94,28.1 | v41.91,26.83 v41.91,38.26
TE  (via drill 0.6)
  Top 0.305: v38.42,9.05 52.7,9.05 53.97,7.78 64.45,7.78 IC1.1
  Bottom 0.305: J1.9 36.51,28.1 37.46,27.15 37.46,10 v38.42,9.05 | IC1.1 67.94,6.51 69.21,5.24 76.36,5.24 77.63,6.51 IC2.1
VCC  (via drill 0.6)
  Top 0.305: 58.1,3.33 C2.1
  Top 0.61: 57.47,31.91 48.89,31.91 48.26,31.27 v48.26,29.69 48.58,29.37 54.93,29.37 57.47,31.91 | 57.47,31.91 57.63,31.91
  Top 0.813: 57.63,31.91 57.63,35.24 58.1,35.72 IC3.14 | C1.+ 28.42,57.78 45.08,48.26 45.08,43.5 48.26,40.8 J1.27 | C3.1 73.34,3.33 IC2.20 75.88,6.51 77.15,7.78 87.63,7.78 91.12,11.27 R1.1 | IC1.20 58.1,3.33
  Bottom 0.305: 57.78,36.67 IC3.14 | 62.39,31.43 C4.1
  Bottom 0.813: C4.1 59.69,33.18 57.78,35.08 57.78,36.67 | C5.1 IC4.14 70.48,36.99 69.21,38.26 59.37,38.26 IC3.14 56.67,36.99 52.86,40.8 J1.27 48.74,40.8 47.31,39.37 47.31,35.08 47.47,35.08 48.26,34.29 v48.26,29.69 | IC1.20 61.12,6.51 62.39,7.78 | 62.39,7.78 68.26,7.78 69.53,6.51 IC2.20 | 62.39,7.78 62.39,31.43

### Text on the board
Top: NANO- / IEEE488- / V1.1B | (C) A. Fachat
tPlace: JP2: / 1-2: LED / 2-3: REN | Close SJ1 / for DC low
tNames: ON / ATNA / OFF | NANO- / IEEE488- / V1.1B | (C) A. Fachat